# Altium schematic sheet AnalogParts.SchDoc
size 381 x 241 mm; SheetNumber: 2; SheetTotal: 4
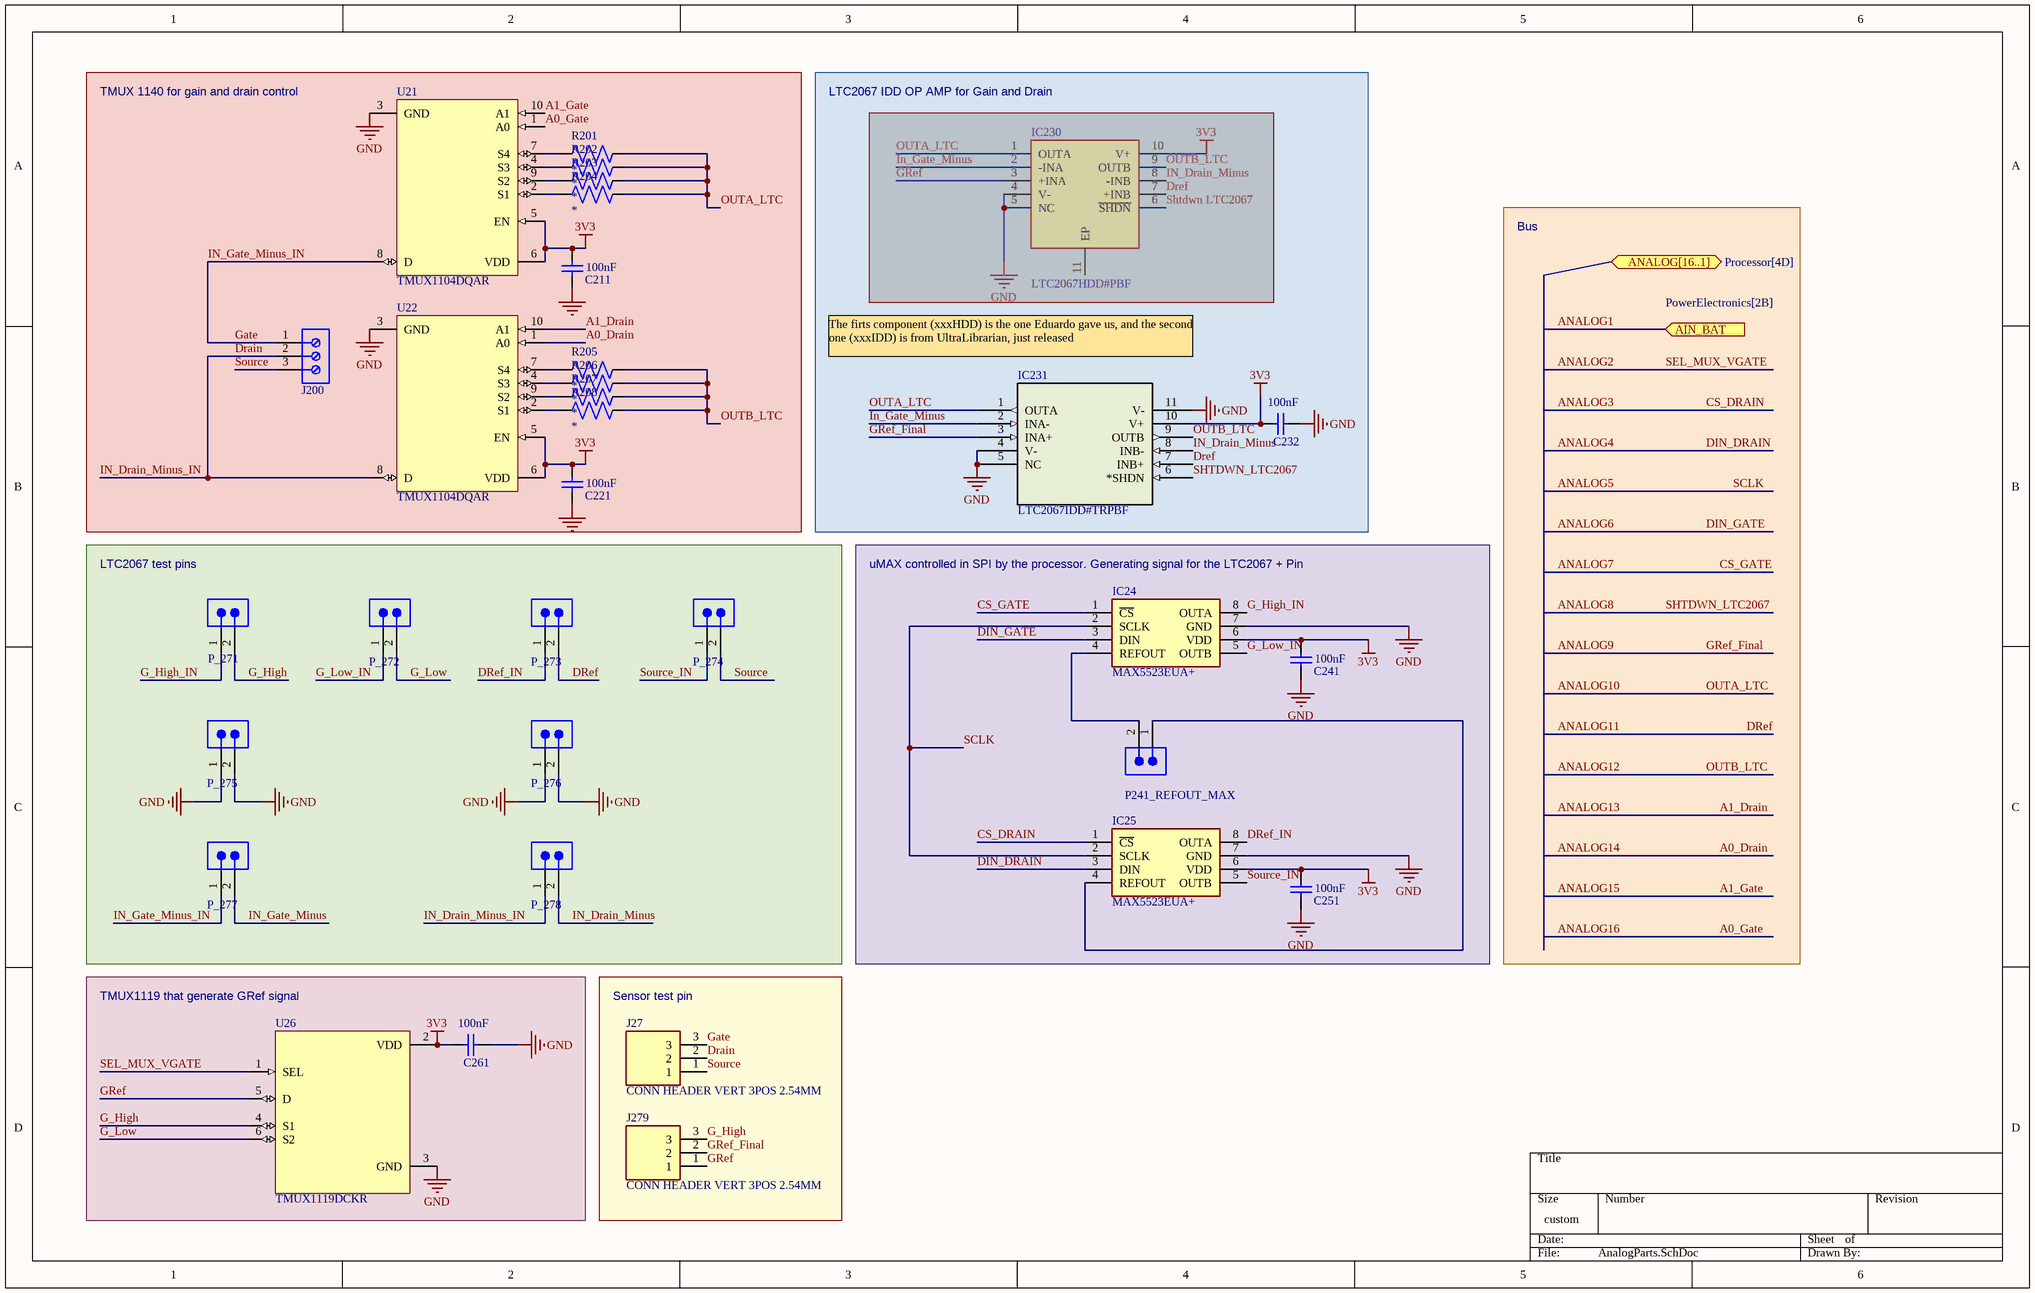
[diagram p0: AnalogParts.SchDoc]

## Parts
C211  100nF  [CAPC1608X06L]
C221  100nF  [CAPC1608X06L]
C232  100nF  [CAPC1608X06L]
C241  100nF  [CAPC1608X06L]
C251  100nF  [CAPC1608X06L]
C261  100nF  [CAPC1608X06L]
IC24  MAX5523EUA+  [MAX5523EUA+]
IC25  MAX5523EUA+  [MAX5523EUA+]
IC230  LTC2067HDD#PBF  [LTC2067HDD#PBF]  (masked out: inside a compile mask, not in the netlist)
IC231  LTC2067IDD#TRPBF  [05-08-1699_ADI]
J27  CONN HEADER VERT 3POS 2.54MM  [CONN HEADER VERT 3POS 2.54MM]
J200  691210910003  [CONN_3P_691210910003]  (value not drawn)
J279  CONN HEADER VERT 3POS 2.54MM  [CONN HEADER VERT 3POS 2.54MM]
P241_REFOUT_MAX  Pin header 2p  [Pin_header_1x2]  (value not drawn)
P_271  Pin header 2p  [Pin_header_1x2]  (value not drawn)
P_272  Pin header 2p  [Pin_header_1x2]  (value not drawn)
P_273  Pin header 2p  [Pin_header_1x2]  (value not drawn)
P_274  Pin header 2p  [Pin_header_1x2]  (value not drawn)
P_275  Pin header 2p  [Pin_header_1x2]  (value not drawn)
P_276  Pin header 2p  [Pin_header_1x2]  (value not drawn)
P_277  Pin header 2p  [Pin_header_1x2]  (value not drawn)
P_278  Pin header 2p  [Pin_header_1x2]  (value not drawn)
R201  *  [RESC1608X04.5L]
R202  *  [RESC1608X04.5L]
R203  *  [RESC1608X04.5L]
R204  *  [RESC1608X04.5L]
R205  *  [RESC1608X04.5L]
R206  *  [RESC1608X04.5L]
R207  *  [RESC1608X04.5L]
R208  *  [RESC1608X04.5L]
U21  TMUX1104DQAR  [TMUX1104DQAR]
U22  TMUX1104DQAR  [TMUX1104DQAR]
U26  TMUX1119DCKR  [SC70_200X125_6N]

## Blocks framed on the sheet
TMUX 1140 for gain and drain control: C211 C221 J200 R201-R208 U21 U22
LTC2067 IDD OP AMP for Gain and Drain: C232 IC230 IC231
LTC2067 test pins: P_271-P_278
TMUX1119 that generate GRef signal: C261 U26
Sensor test pin: J27 J279

## Ports
AIN_BAT (in, see PowerElectronics[2B]), ANALOG[16..1] (bidir, see Processor[4D])

## Nets
3V3: C211.1 C221.1 C232.1 C241.1 C251.1 C261.1 IC24.6(VDD) IC25.6(VDD) IC231.10(V+) U21.5(EN) U21.6(VDD) U22.5(EN) U22.6(VDD) U26.2(VDD)
GND: C211.2 C221.2 C232.2 C241.2 C251.2 C261.2 IC24.7(GND) IC25.7(GND) IC231.4(V-) IC231.5(NC) IC231.11(V-) P_275.1 P_275.2 P_276.1 P_276.2 U21.3(GND) U22.3(GND) U26.3(GND)
A0_Drain: U22.1(A0)  [also labelled ANALOG14]
A0_Gate: U21.1(A0)  [also labelled ANALOG16]
A1_Drain: U22.10(A1)  [also labelled ANALOG13]
A1_Gate: U21.10(A1)  [also labelled ANALOG15]
ANALOG1: port AIN_BAT
ANALOG2: U26.1(SEL)  [also labelled SEL_MUX_VGATE]
ANALOG3: IC25.1(~{CS})  [also labelled CS_DRAIN]
ANALOG4: IC25.3(DIN)  [also labelled DIN_DRAIN]
ANALOG5: IC24.2(SCLK) IC25.2(SCLK)  [also labelled SCLK]
ANALOG6: IC24.3(DIN)  [also labelled DIN_GATE]
ANALOG7: IC24.1(~{CS})  [also labelled CS_GATE]
ANALOG8: IC231.6(*SHDN)  [also labelled SHTDWN_LTC2067]
ANALOG9: IC231.3(INA+) J279.2  [also labelled GRef_Final]
ANALOG10: IC231.1(OUTA) R201.2 R202.2 R203.2 R204.2  [also labelled OUTA_LTC]
ANALOG11: IC231.7(INB+) P_273.2  [also labelled Dref]
ANALOG12: IC231.9(OUTB) R205.2 R206.2 R207.2 R208.2  [also labelled OUTB_LTC]
Drain: J27.2 J200.2 P_278.1 U22.8(D)  [also labelled IN_Drain_Minus_IN]
DRef_IN: IC25.8(OUTA) P_273.1
G_High: J279.3 P_271.2 U26.4(S1)
G_High_IN: IC24.8(OUTA) P_271.1
G_Low: P_272.2 U26.6(S2)
G_Low_IN: IC24.5(OUTB) P_272.1
Gate: J27.3 J200.1 P_277.1 U21.8(D)  [also labelled IN_Gate_Minus_IN]
GRef: J279.1 U26.5(D)
IN_Drain_Minus: IC231.8(INB-) P_278.2
In_Gate_Minus: IC231.2(INA-) P_277.2
Source: J27.1 J200.3 P_274.2
Source_IN: IC25.5(OUTB) P_274.1
NetIC24_4: IC24.4(REFOUT) P241_REFOUT_MAX.2
NetIC25_4: IC25.4(REFOUT) P241_REFOUT_MAX.1
NetR201_1: R201.1 U21.7(S4)
NetR202_1: R202.1 U21.4(S3)
NetR203_1: R203.1 U21.9(S2)
NetR204_1: R204.1 U21.2(S1)
NetR205_1: R205.1 U22.7(S4)
NetR206_1: R206.1 U22.4(S3)
NetR207_1: R207.1 U22.9(S2)
NetR208_1: R208.1 U22.2(S1)

## Notes on the sheet
- Bus
- The firts component (xxxHDD) is the one Eduardo gave us, and the second one (xxxIDD) is from UltraLibrarian, just released
- (near IC24) uMAX controlled in SPI by the processor. Generating signal for the LTC2067 + Pin

## Library data of the parts
C211 C221 C232 C241 C251 C261 = C0603-4µ7: Capacitor, X5R, ±10%; Value: 4.7µF
IC24 IC25 = MAX5523EUA+: Integrated Circuit; Manufacturer_Name: Analog Devices; Datasheet Link: https://pdfserv.maximintegrated.com/en/ds/MAX5522-MAX5525.pdf; Height: 1.1mm; Manufacturer_Part_Number: MAX5523EUA+; Mouser Part Number: 700-MAX5523EUA; Mouser Price/Stock: https://www.mouser.co.uk/ProductDetail/Analog-Devices-Maxim-Integrated/MAX5523EUA%2b?qs=9Cj2FLRihcNj5G7tv6WL1A%3D%3D
IC230 = LTC2067HDD#PBF: Integrated Circuit; Manufacturer_Name: Analog Devices; Datasheet Link: https://datasheet.datasheetarchive.com/originals/distributors/DKDS41/DSANUWW0020938.pdf; Height: 0.8mm; Manufacturer_Part_Number: LTC2067HDD#PBF; Mouser Part Number: 584-LTC2067HDD#PBF; Mouser Price/Stock: https://www.mouser.com/Search/Refine.aspx?Keyword=584-LTC2067HDD%23PBF; Arrow Part Number: LTC2067HDD#PBF; Arrow Price/Stock: https://www.arrow.com/en/products/ltc2067hddpbf/analog-devices
IC231 = LTC2067IDD#TRPBF: No Description Available; Mfr_Name: Analog Devices Inc; Type: Linear; RefDes: RefDes
J27 J279 = CONN HEADER VERT 3POS 2.54MM: Connector; Manufacturer_Name: Wurth Elektronik; Manufacturer_Part_Number: 61300311121; Datasheet Link: http://katalog.we-online.de/em/datasheet/6130xx11121.pdf; Height: 8.69mm; Mouser Part Number: 710-61300311121; Mouser Price/Stock: https://www.mouser.co.uk/ProductDetail/Wurth-Elektronik/61300311121?qs=PhR8RmCirEYxRWFJzNKsUw%3D%3D
J200 = CONN_3P_691210910003: WR-TBL Series 2109 Horizontal Entry, THT, pitch 2.54mm, 3p; Manufacturer: Wurth Elektronik; Modularity: No; Rated Current: 6A; Working Voltage: 150V; ComponentLink1Description: Website Link; ComponentLink1URL: https://www.we-online.com/redexpert/article/691210910003?ad; ComponentLink2Description: Datasheet Link; ComponentLink2URL: https://www.we-online.com/redexpert/spec/691210910003?ad; Manufacturer Part Number: 691210910003; Category: Terminal Blocks; Match Code: WR-TBL; Mount: Through Hole; Operating Temperature Max: 105°C; Operating Temperature Min: -40°C; Packaging: Box; Application: Rising Cage Clamp; Number of Pins: 3; Number of Rows: 1; Orientation: Horizontal; Pitch: 2.54mm
P241_REFOUT_MAX P_271-P_278 = Pin header 2p: Pin Header, THT, Vertical, pitch 2.54mm, 1 Row, 2P; Value: Pin header 2p
R201-R208 = R0603: Resistor, ±1%, 0.063W; Value: *
U21 U22 = TMUX1104DQAR: Multiplexer 4:1, 3-pA on-state leakage current, 1.08v - 5V supply range; Value: TMUX1104DQAR
U26 = TMUX1119DCKR: 2:1 precision switch, low leakage current, 1.08v - 5V supply range; MF: Texas Instruments; Texas_Instruments-Purchase-URL: https://snapeda.com/shop?store=Texas+Instruments&id=3222194; Package: SOT-SC70-6 Texas Instruments; MP: TMUX1119DCKR; Value: TMUX1119DCKR; SnapEDA_Link: https://www.snapeda.com/parts/TMUX1119DCKR/Texas%20Instruments/view-part/3222194/?ref=snap; Price: None; Availability: Unavailable